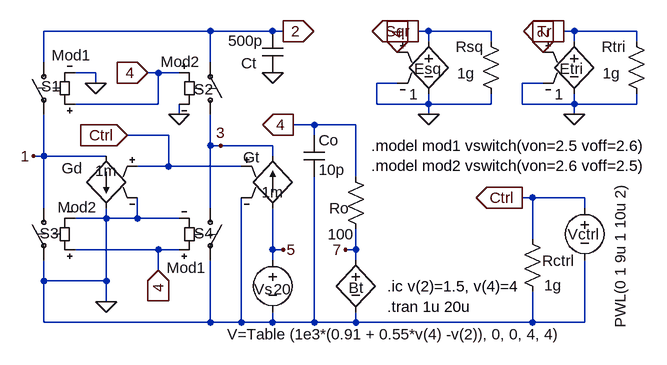
[diagram p0: schematic CurrentSteeringVco.asc]
CurrentSteeringVco.asc, the LTspice schematic file:
Version 4
SHEET 1 940 680
WIRE -304 16 -304 -32
WIRE -304 160 -320 160
WIRE -304 160 -304 96
WIRE -304 240 -304 160
WIRE -304 352 -304 320
WIRE -304 416 -304 352
WIRE -224 32 -256 32
WIRE -224 48 -224 32
WIRE -208 160 -304 160
WIRE -208 256 -256 256
WIRE -208 256 -208 240
WIRE -208 352 -304 352
WIRE -208 352 -208 256
WIRE -208 384 -208 352
WIRE -160 256 -208 256
WIRE -160 256 -160 224
WIRE -128 32 -144 32
WIRE -128 80 -256 80
WIRE -128 80 -128 32
WIRE -128 304 -256 304
WIRE -128 336 -128 304
WIRE -112 128 -176 128
WIRE -112 176 -160 176
WIRE -112 176 -112 128
WIRE -96 32 -128 32
WIRE -96 96 -96 80
WIRE -96 256 -160 256
WIRE -96 304 -128 304
WIRE -48 -32 -304 -32
WIRE -48 16 -48 -32
WIRE -48 144 -48 96
WIRE -48 240 -48 144
WIRE -48 416 -304 416
WIRE -48 416 -48 320
WIRE -32 144 -48 144
WIRE 0 176 -112 176
WIRE 0 416 -48 416
WIRE 0 416 0 224
WIRE 48 -32 -48 -32
WIRE 48 144 -32 144
WIRE 48 160 48 144
WIRE 48 304 48 240
WIRE 48 320 48 304
WIRE 48 416 0 416
WIRE 48 416 48 400
WIRE 64 -32 48 -32
WIRE 64 304 48 304
WIRE 112 112 80 112
WIRE 112 128 112 112
WIRE 112 416 48 416
WIRE 112 416 112 192
WIRE 176 112 112 112
WIRE 176 192 176 112
WIRE 176 304 160 304
WIRE 176 304 176 272
WIRE 176 320 176 304
WIRE 176 416 112 416
WIRE 176 416 176 400
WIRE 208 80 208 48
WIRE 240 48 208 48
WIRE 288 -32 272 -32
WIRE 288 -16 288 -32
WIRE 288 80 208 80
WIRE 288 80 288 64
WIRE 288 96 288 80
WIRE 384 -32 288 -32
WIRE 384 -16 384 -32
WIRE 384 80 288 80
WIRE 384 80 384 64
WIRE 432 80 432 48
WIRE 448 224 432 224
WIRE 448 288 448 224
WIRE 448 416 176 416
WIRE 448 416 448 368
WIRE 464 48 432 48
WIRE 512 -32 496 -32
WIRE 512 -16 512 -32
WIRE 512 80 432 80
WIRE 512 80 512 64
WIRE 512 96 512 80
WIRE 528 224 448 224
WIRE 528 240 528 224
WIRE 528 416 448 416
WIRE 528 416 528 320
WIRE 608 -32 512 -32
WIRE 608 -16 608 -32
WIRE 608 80 512 80
WIRE 608 80 608 64
FLAG -224 48 0
FLAG -144 32 4
IOPIN -144 32 In
FLAG -96 96 0
FLAG 80 112 4
IOPIN 80 112 Out
FLAG 64 -32 2
IOPIN 64 -32 Out
FLAG -320 160 1
FLAG -208 384 0
FLAG -32 144 3
FLAG -128 336 4
IOPIN -128 336 In
FLAG 64 304 5
FLAG 160 304 7
FLAG 48 32 0
FLAG 432 224 Ctrl
IOPIN 432 224 Out
FLAG 288 96 0
FLAG 272 -32 Sqr
IOPIN 272 -32 Out
FLAG 240 0 4
IOPIN 240 0 In
FLAG 512 96 0
FLAG 496 -32 Tri
IOPIN 496 -32 Out
FLAG 464 0 2
IOPIN 464 0 In
FLAG -176 128 Ctrl
IOPIN -176 128 In
SYMBOL sw -304 0 M0
WINDOW 0 -25 53 Left 0
WINDOW 3 -73 5 Left 0
SYMATTR InstName S1
SYMATTR Value Mod1
SYMBOL sw -48 112 M180
WINDOW 0 -25 55 Left 0
WINDOW 3 -76 97 Left 0
SYMATTR InstName S2
SYMATTR Value Mod2
SYMBOL sw -304 224 M0
WINDOW 0 -23 55 Left 0
WINDOW 3 -82 15 Left 0
SYMATTR InstName S3
SYMATTR Value Mod2
SYMBOL sw -48 224 R0
WINDOW 0 -25 55 Left 0
WINDOW 3 -67 108 Left 0
SYMATTR InstName S4
SYMATTR Value Mod1
SYMBOL voltage 48 304 R0
WINDOW 0 -28 61 Left 0
WINDOW 3 2 61 Left 0
SYMATTR InstName Vs
SYMATTR Value 20
SYMBOL bv 176 304 R0
WINDOW 0 -11 59 Left 0
WINDOW 3 -198 130 Left 0
SYMATTR InstName Bt
SYMATTR Value V=Table (1e3*(0.91 + 0.55*v(4) -v(2)), 0, 0, 4, 4)
SYMBOL cap 32 -32 R0
WINDOW 0 -32 49 Left 0
WINDOW 3 -52 15 Left 0
SYMATTR InstName Ct
SYMATTR Value 500p
SYMBOL res 160 176 R0
WINDOW 0 -25 64 Left 0
WINDOW 3 -27 104 Left 0
SYMATTR InstName Ro
SYMATTR Value 100
SYMBOL cap 96 128 R0
WINDOW 0 23 8 Left 0
WINDOW 3 23 53 Left 0
SYMATTR InstName Co
SYMATTR Value 10p
SYMBOL voltage 528 224 R0
WINDOW 0 -26 56 Left 0
WINDOW 3 55 -23 VRight 0
WINDOW 123 0 0 Left 0
WINDOW 39 0 0 Left 0
SYMATTR InstName Vctrl
SYMATTR Value PWL(0 1 9u 1 10u 2)
SYMBOL res 432 272 R0
WINDOW 0 31 49 Left 0
WINDOW 3 34 87 Left 0
SYMATTR InstName Rctrl
SYMATTR Value 1g
SYMBOL e 288 -32 R0
WINDOW 0 -22 58 Left 0
WINDOW 3 -30 97 Left 0
SYMATTR InstName Esq
SYMATTR Value 1
SYMBOL res 368 -32 R0
WINDOW 0 -38 24 Left 0
WINDOW 3 -36 65 Left 0
SYMATTR InstName Rsq
SYMATTR Value 1g
SYMBOL e 512 -32 R0
WINDOW 0 -22 58 Left 0
WINDOW 3 -30 97 Left 0
SYMATTR InstName Etri
SYMATTR Value 1
SYMBOL res 592 -32 R0
WINDOW 0 -38 24 Left 0
WINDOW 3 -36 65 Left 0
SYMATTR InstName Rtri
SYMATTR Value 1g
SYMBOL g 48 144 R0
WINDOW 0 -45 18 Left 0
WINDOW 3 -17 72 Left 0
SYMATTR InstName Gt
SYMATTR Value 1m
SYMBOL g2 -208 256 R180
WINDOW 0 36 77 Left 0
WINDOW 3 -17 73 Left 0
SYMATTR InstName Gd
SYMATTR Value 1m
TEXT 200 144 Left 0 !.model mod1 vswitch(von=2.5 voff=2.6)\n.model mod2 vswitch(von=2.6 voff=2.5)
TEXT 224 360 Left 0 !.ic v(2)=1.5, v(4)=4
TEXT 224 392 Left 0 !.tran 1u 20u

The netlist it stands for:
* CurrentSteeringVco.asc
S1 2 1 4 0 Mod1
S2 3 2 4 0 Mod2
S3 1 0 4 0 Mod2
S4 3 0 4 0 Mod1
Vs 5 0 20
Bt 7 0 V=Table (1e3*(0.91 + 0.55*v(4) -v(2)), 0, 0, 4, 4)
Ct 2 0 500p
Ro 4 7 100
Co 4 0 10p
Vctrl Ctrl 0 PWL(0 1 9u 1 10u 2)
Rctrl Ctrl 0 1g
Esq Sqr 0 4 0 1
Rsq Sqr 0 1g
Etri Tri 0 2 0 1
Rtri Tri 0 1g
Gt 5 3 Ctrl 0 1m
Gd 1 0 Ctrl 0 1m
.model mod1 vswitch(von=2.5 voff=2.6)
.model mod2 vswitch(von=2.6 voff=2.5)
.ic v(2)=1.5, v(4)=4
.tran 1u 20u
.backanno
.end